# Altium schematic sheet 1power.SchDoc
size A4; SheetNumber: 1; SheetTotal: 2
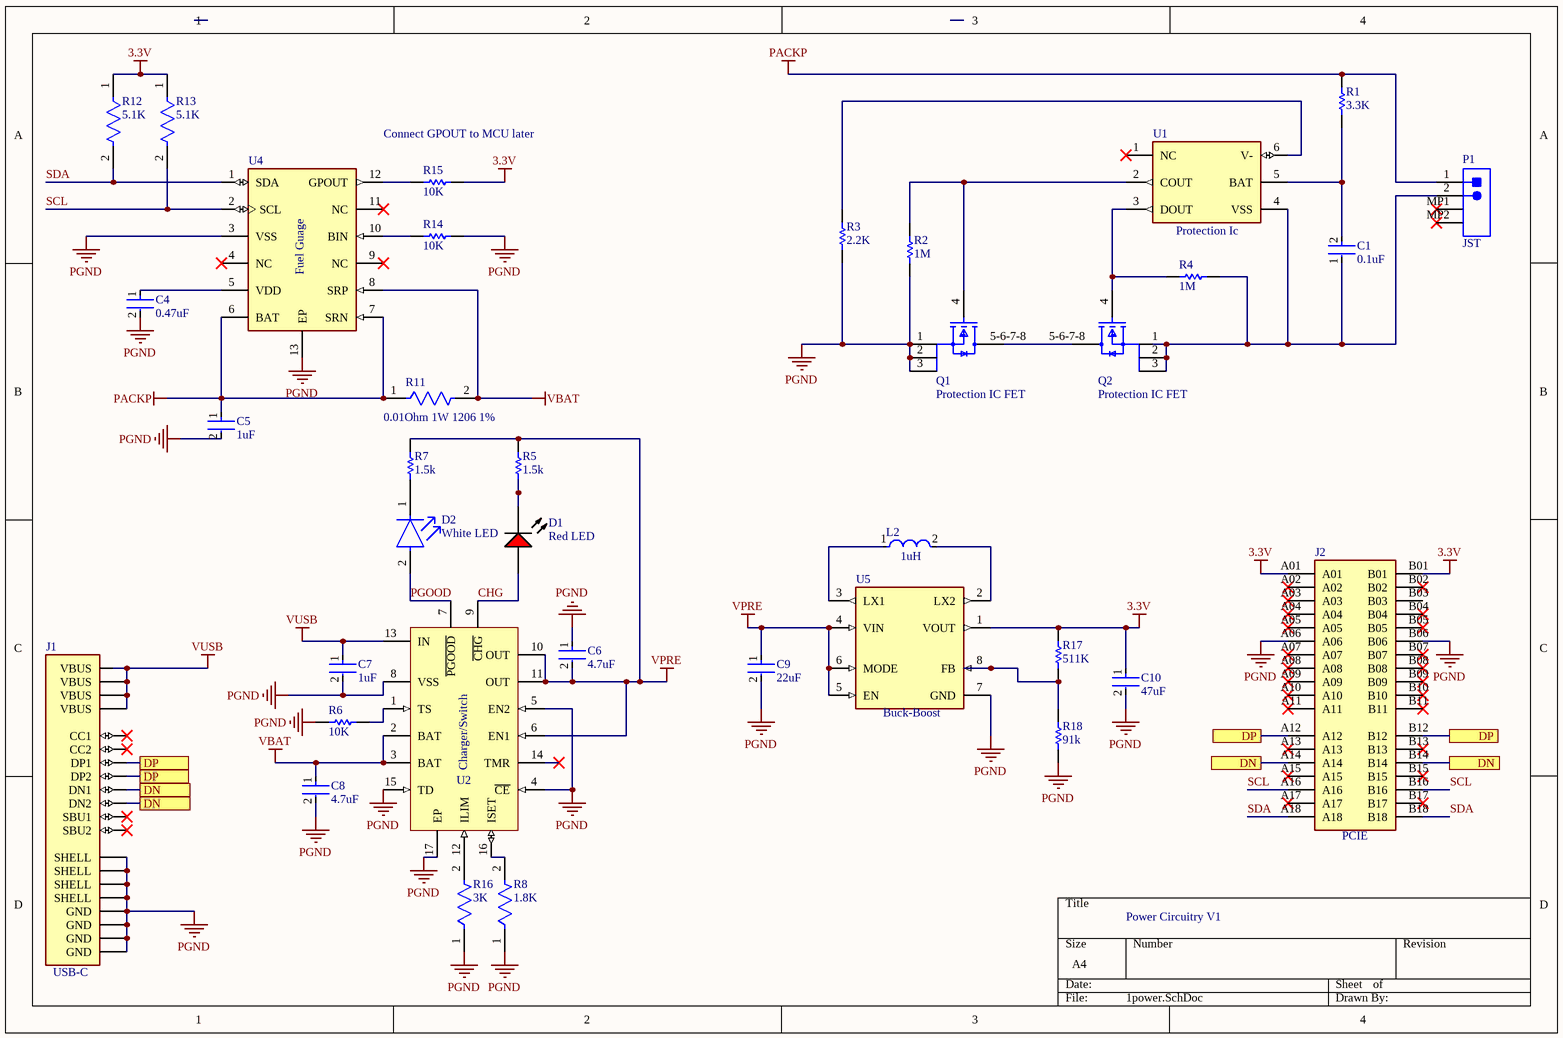
[diagram p0: 1power.SchDoc]

## Parts
C1  0.1uF  [FP-GRM15-MFG]
C4  0.47uF  [FP-C0603C-CF-MFG]
C5  1uF  [FP-C0402C105K8PACTU-MFG]
C6  4.7uF  [FP-ZRB15X-0_15-MFG]
C7  1uF  [FP-C0402C105K8PACTU-MFG]
C8  4.7uF  [FP-ZRB15X-0_15-MFG]
C9  22uF  [FP-GRM187-0_2-IPC_C]
C10  47uF  [FP-GRM219-0_2-0_1-IPC_A]
D1  Red LED  [VISH-TLMS1000_V]
D2  White LED  [FP-6_541-5091_01-4-MFG]
J1  USB-C  [GCT_USB4085-GF-A_REVB]
J2  PCIE  [SAMTEC_PCIE-036-02-X-D-EMS3]
L2  1uH  [FP-DFE252012C-IPC_B]
P1  JST  [JST- S2B-PH-SM4-TB(LF)(SN)-2_V]
Q1  Protection IC FET  [FP-DQG0008A-MFG]
Q2  Protection IC FET  [FP-DQG0008A-MFG]
R1  3.3K  [RESC1005X40X25LL05T10]
R2  1M  [RESC1005X40X25NL05T10]
R3  2.2K  [RESC1005X40X25NL05T10]
R4  1M  [RESC1005X40X25NL05T10]
R5  1.5k  [RESC1005X40X25ML05T10]
R6  10K  [RESC1005X40X25LL05T10]
R7  1.5k  [RESC1005X40X25ML05T10]
R8  1.8K  [FP-CRCW0603-e3-IPC_A]
R11  0.01Ohm 1W 1206 1%  [FP-WSLP1206-FP_1_65x1_93x-MFG]
R12  5.1K  [FP-CRCW0402-e3-IPC_A]
R13  5.1K  [FP-CRCW0402-e3-IPC_A]
R14  10K  [RESC1005X40X25LL05T10]
R15  10K  [RESC1005X40X25LL05T10]
R16  3K  [FP-CRCW0603-e3-MFG]
R17  511K  [RESC1005X40X25ML05T05]
R18  91k  [RESC1005X40X25NL05T10]
U1  Protection Ic  [FP-DSE0006A-IPC_A]
U2  Charger/Switch  [RGT0016C_V]
U4  Fuel Guage  [FP-DRZ0012A-MFG]
U5  Buck-Boost  [SOT50P160X60-8N]

## Ports
DN (see 1power[1D], 1power[4C]), DP (see 1power[1C], 1power[1D], 1power[4C]), DP (see 1power[1C], 1power[4C]), DP (see 1power[1D], 1power[4C])

## Nets
3.3V: C10.1 J2.A01 J2.B01 R12.1 R13.1 R15.2 R17.2 U5.1(VOUT)
PACKP: C5.1 P1.1 R1.1 R11.1 U4.6(BAT) U4.7(SRN)
PGND: C4.2 C5.2 C6.1 C7.2 C8.2 C9.2 C10.2 J1.A1(GND) J1.A12(GND) J1.B1(GND) J1.B12(GND) J1.S1(SHELL) J1.S2(SHELL) J1.S3(SHELL) J1.S4(SHELL) J2.A06 J2.B06 Q1.1(S) Q1.2(S) Q1.3(S) R2.1 R3.1 R6.1 R8.1 R14.2 R16.1 R18.1 U2.4(~{CE}) U2.5(EN2) U2.8(VSS) U2.15(TD) U2.17(EP) U4.3(VSS) U4.13(EP) U5.7(GND)
VBAT: C8.1 R11.2 U2.2(BAT) U2.3(BAT) U4.8(SRP)
VPRE: C6.2 C9.1 R5.2 R7.2 U2.6(EN1) U2.10(OUT) U2.11(OUT) U5.4(VIN) U5.5(EN) U5.6(MODE)
VUSB: C7.1 J1.A4(VBUS) J1.A9(VBUS) J1.B4(VBUS) J1.B9(VBUS) U2.13(IN)
CHG: D1.1(A) U2.9(~{CHG})
DN: J1.A7(DN1) J1.B7(DN2) J2.A14 J2.B14 ; port DN
DP: J1.A6(DP1) J1.B6(DP2) J2.A12 J2.B12 ; port DP
PGOOD: D2.2(A) U2.7(~{PGOOD})
SCL: J2.A16 J2.B16 R13.2 U4.2(SCL)
SDA: J2.A18 J2.B18 R12.2 U4.1(SDA)
NetC1_1: C1.1 P1.2 Q2.1(S) Q2.2(S) Q2.3(S) R4.2 U1.4(VSS)
NetC1_2: C1.2 R1.2 U1.5(BAT)
NetC4_1: C4.1 U4.5(VDD)
NetD1_2: D1.2(K) R5.1
NetD2_1: D2.1(C) R7.1
NetL2_1: L2.1 U5.3(LX1)
NetL2_2: L2.2 U5.2(LX2)
NetQ1_4: Q1.4(G) R2.2 U1.2(COUT)
NetQ1_5-6-7-8: Q1.5-6-7-8(D) Q2.5-6-7-8(D)
NetQ2_4: Q2.4(G) R4.1 U1.3(DOUT)
NetR3_2: R3.2 U1.6(V-)
NetR6_2: R6.2 U2.1(TS)
NetR8_2: R8.2 U2.16(ISET)
NetR14_1: R14.1 U4.10(BIN)
NetR15_1: R15.1 U4.12(GPOUT)
NetR16_2: R16.2 U2.12(ILIM)
NetR17_1: R17.1 R18.2 U5.8(FB)

Not connected (* = marked no-connect by the designer): J1 A5(CC1)* A8(SBU1)* B5(CC2)* B8(SBU2)*; J2 A02* A03* A04* A05* A07* A08* A09* A10* A11* A13* A15* A17* B02* B03 B04* B05* B07* B08* B09* B10* B11* B13* B15* B17*; P1 MP1* MP2*; U1 1(NC)*; U2 14(TMR)*; U4 4(NC)* 9(NC)* 11(NC)*

## Notes on the sheet
- Connect GPOUT to MCU later
- Power Circuitry V1

## Library data of the parts
C1 = CMP-2100-03641-2: CAP CER 0.1UF 16V X7R 0402; Manufacturer Part Number: GRM155R71C104KA88D; Manufacturer: Murata; Standoff Height: 0mm; Tolerance: 10%; Voltage Rating: 16Vdc; Material: Ceramic; Capacitance: 0.10μF; Value: 0.10μF; RoHS: TRUE; Temperature Characteristic: X7R; Octopart: https://octopart.com/grm155r71c104ka88d-murata-196880; Digikey Description: CAP CER 0.1UF 16V X7R 0402; Device Class L3: Ceramic Capacitors; Height: 0.55mm; ComponentLink2Description: Datasheet; Temperature Range Low: -55°C; Ipc Land Pattern Name: CAPC10050X219; ComponentLink2URL: https://search.murata.co.jp/Ceramy/image/img/A01X/G101/ENG/GRM155R71H471KA01-01A.pdf; Device Class L1: Passive Components; Lead Free: yes; Category: Cap; Package: GRM15; Temperature: -55°C to +125°C; Device Class L2: Capacitors; Temperature Range High: +125°C; Mouser Description: 0402 0.1 uF 16V ±10 % Tolerance X7R SMT Multilayer Ceramic Capacitor
C4 = CMP-2006-03235-2: CAP CER 0.47UF 16V X7R 0603; Manufacturer Part Number: C0603C474K4RACTU; Manufacturer: KEMET; Automotive Grade: Grade 1; Value: 0.47 μF; Tolerance: 0.1; Temperature Coefficient: 30ppm/°C; Material: Ceramic; Device Class L3: Ceramic Capacitors; ComponentLink2URL: https://api.kemet.com/component-edge/download/datasheet/C0603C100J5GACAUTO.pdf; Height: 0.87mm; ComponentLink2Description: Datasheet; Device Class L2: Capacitors; Temperature Range Low: -55°C; Temperature Range High: +125°C; RoHS: TRUE; Mouser Description: 0603 C 470nF Ceramic Multilayer Capacitor, 16 V, +125degC, X7R Dielec, +/-10%; Temperature Characteristic: X7R; Digikey Description: CAP CER 0.47UF 16V X7R 0603; Lead Free: Yes; Automotive: Yes; Octopart: https://octopart.com/c0603c474k4ractu-kemet-109683; Capacitance: 0.47 μF; Package: C0603C-CF; Voltage Rating: 16 V; Device Class L1: Passive Components; Category: Cap; Temperature: -55°C to +125°C
C5 C7 = CMP-2008-02081-2: CAP CER 1UF 10V X5R 0402; Dielectric Material: Ceramic; Dissipation Factor: 5%; Tolerance: 10%; Number of Pins: 2; Contact Plating: Tin; Min Operating Temperature: -55°C; Termination: SMD/SMT; Lead Free: Lead Free; Construction: Flat; Voltage Rating (DC): 10V; Mount: Surface Mount; Series: C; Thickness: 0.022inch; Width: 0.5mm; Radiation Hardening: No; Capacitance: 1uF; Dielectric: X5R; Height: 0.5mm; Voltage: 10V; Length: 1mm; Depth: 0.5mm; Max Operating Temperature: 85°C; Package Quantity: 1; Packaging: Tape and Reel; RoHS Compliant: Yes; Case Code (Imperial): 0402; Case Code (Metric): 1005; REACH SVHC: No SVHC; Voltage Rating: 10V; Case/Package: 0402
C6 C8 = CMP-06035-062377-1: CAP CER 4.7UF 10V X5R 0402; Tolerance: 20%; Case Code (Metric): 1005; Height: 0.65mm; Mount: Surface Mount; Voltage Rating: 10V; Case/Package: 0402; Max Operating Temperature: 85°C; Width: 0.02inch; Min Operating Temperature: -55°C; Thickness: 0.031inch; Length: 0.039inch; Dielectric: X5R; Voltage Rating (DC): 10V; Capacitance: 4.7uF; Voltage: 10V; REACH SVHC: No SVHC; RoHS Compliant: Yes; Packaging: Cut Tape; Depth: 0.5mm; Case Code (Imperial): 0402
C9 = CMP-06035-049226-1: Chip Multilayer Ceramic Capacitors for General Purpose, 0603, 22uF, X5R, 15%, 20%, 10V; Dielectric: X5R; Capacitance: 22uF; Voltage Rating: 10V; Case/Package: 0603; Case Code (Imperial): 0603; Voltage Rating (DC): 10V; Mount: Surface Mount; Length: 0.063inch; Width: 0.031inch; Max Operating Temperature: 85°C; Thickness: 0.031inch; Tolerance: 20%; Case Code (Metric): 1608; Packaging: Tape and Reel; Min Operating Temperature: -55°C
C10 = CMP-06035-004086-1: Chip Multilayer Ceramic Capacitors for General Purpose, 0805, 47uF, X5R, 15%, 20%, 6.3V; Case Code (Metric): 2012; Voltage Rating: 6.3V; Case Code (Imperial): 0805; Max Operating Temperature: 85°C; Width: 0.049inch; Length: 0.079inch; Min Operating Temperature: -55°C; Mount: Surface Mount; Packaging: Tape and Reel; Case/Package: 0805; Thickness: 0.037inch; Capacitance: 47uF; Tolerance: 20%
D1 = CMP-2000-07254-1: Low Current LED, 40 mW, 1.8 V, -40 to 100 degC, 2-Pin SMD (0603), RoHS, Tape and Reel; Manufacturer: Vishay; Lens Shape: Rectangular; Automotive Qualification Standard: AEC-Q100; Wavelength Typ: 636nm; SVHC: ToBeAdvised; Bulb Size: 1.6mmx0.8mm; Forward Voltage: 1.8V; Luminous Intensity: 4mcd; Forward Current If: 2mA; Viewing Angle: 80°; Datasheet Version: Rev. 1.7, 02/2011; Datasheet URL: https://datasheet.ciiva.com/5798/1698881-5798337.pdf; LED Mounting: SMD; Packaging: CutTape; Package Reference: TLMS1000; Manufacturer URL: http://www.vishay.com/; Mounting Technology: SurfaceMount; Product Range: -; LED Colour: Red; Package Description: 2-Pin Surface Mount Device, Body 1.6 x 0.8 mm; MSL: MSL2-1year
D2 = CMP-02520-000007-1: LED COOL WHITE 0603 SMD; Manufacturer: Vishay; Manufacturer Part Number: VLMW1300-GS08; Viewing Angle: 130°; Forward Voltage: 3.15V; Luminous Intensity: 180mcd; Forward Current: 5mA; Led Orientation: Top View; Power Dissipation: 70mW; Category: Diode; Device Class L2: LEDs; Device Class L1: Optoelectronics; ComponentLink2URL: http://www.vishay.com/docs/82435/vlmw1300.pdf; Octopart: https://octopart.com/vlmw1300-gs08-vishay-21709203; Mouser Description: LED; SMD; 0603; white cold; 45-180mcd; 7000(typ)K; 130°; 5mA; Automotive: No; Ambient Temperature Range High: +80°C; Colour: White; Device Class L3: unset; Temperature Range High: +80°C; Height: 0.75mm; Package: 6.541-5091.01-4; RoHS: TRUE; Digikey Description: LED COOL WHITE 0603 SMD; Lead Free: Yes; Ambient Temperature Range Low: -20°C; ComponentLink2Description: Datasheet; Temperature Range Low: -20°C; Temperature: -20°C to +80°C
J1 = USB4085-GF-A_REVB: USB-C (USB TYPE-C) USB 2.0 æ’åº§è¿žæŽ¥å™¨ 24 (16+8 Dummy) ä½é€šå­”ã€ç›´è§’ã€ä½Žæˆæœ¬ã€3.46mm å¤–å½¢ã€16 é’ˆã€æ°´å¹³ã€é¡¶éƒ¨å®‰è£…; MF: Global Connector Technology; SnapEDA_Link: https://www.snapeda.com/parts/USB4085-GF-A/Global+Connector+Technology/view-part/?ref=snap; Package: None; Value: *; MP: USB4085-GF-A; Check_prices: https://www.snapeda.com/parts/USB4085-GF-A/Global+Connector+Technology/view-part/?ref=eda
J2 = PCIE-036-02-X-D-EMS3: PCI EXPRESS EDGE MOUNT ASSEMBLY,36PINS.; Package: None; Price: None; Value: *; MP: PCIE-036-02-X-D-EMS3; Availability: Unavailable
L2 = CMP-06042-006150-1: Shielded Wirewound Inductor 1uH 20% 3200mA 0.042Ω 1008 (2520), DFE252012P-1R0M=P2; Core Material: Ferrite; Current Rating: 4.3A; Test Frequency: 1MHz; DC Resistance (DCR): 42mR; Max DC Current: 3.2A; Tolerance: 20%; Resistor Type: Wirewound; Inductance: 1uH; Length: 0.098inch; Min Operating Temperature: -40°C; Case Code (Imperial): 1008; Mount: Surface Mount; Depth: 2mm; Height - Seated (Max): 0.039inch; Max Operating Temperature: 125°C; Width: 0.079inch; Case/Package: 1008; Packaging: Tape and Reel; Case Code (Metric): 2520; Shielding: Shielded
P1 = CMP-1755-00001-1: Male Header, Pitch 2 mm, 1 x 2 Position, Height 5.5 mm, -25 to 85 degC, RoHS, Tape and Reel; Current Rating: 3 A; ComponentLink1URL: http://www.jst.com/home2.html; Radiation Hardening: No; RoHSCompliant: True; Mount: Through Hole; Contact Material: Bronze; Package Quantity: 100; Width: 2.34 mm; DatasheetVersion: Dec-12; Height: 8.13 mm; Max Operating Temperature: 105degC; ComponentLink2Description: Datasheet; Lead Pitch: 0.1 inch; Contact Finish: Lead; Packaging: Bulk; Colour: Black; Contact Plating: Tin; Min Operating Temperature: -65degC; ComponentLink1Description: Manufacturer URL; PackageReference: S2B-PH-SM4-TB(LF)(SN)-2; PackageDescription: Male Header, Pitch 2 mm, 1 x 2 Position, Height 5.5 mm; ComponentLink2URL: http://www.jst-mfg.com/product/pdf/eng/ePH.pdf; Pins: 40; Length: 101.19 mm
Q1 Q2 = CMP-04962-000044-1: Protection IC FET, MOSFET N-CH 25V 60A 8-SON, CSD16406Q3; Nominal Vgs: 1.7V; Power Dissipation: 2.7W; Element Configuration: Single; Input Capacitance: 1.1nF; Turn-Off Delay Time: 8.5ns; Number of Elements: 1; Rise Time: 12.9ns; Turn-On Delay Time: 7.3ns; Rds On Max: 5.3mR; Polarity: N-CHANNEL; Gate to Source Voltage (Vgs): 16V; Fall Time: 4.8ns; REACH SVHC: No SVHC; Max Operating Temperature: 150°C; Lead Free: Contains Lead; Contact Plating: Tin; Radiation Hardening: No; Series: NexFET™; Dual Supply Voltage: 25V; Mount: Surface Mount; Continuous Drain Current (ID): 60A; Threshold Voltage: 1.7V; RoHS Compliant: Yes; Package Quantity: 1; Min Operating Temperature: -55°C; Packaging: Tape and Reel; Number of Pins: 8; Termination: SMD/SMT; Max Power Dissipation: 2.7W; Case/Package: SON; Drain to Source Breakdown Voltage: 25V; Drain to Source Voltage (Vdss): 25V; Supplier 1: Mouser; Supplier Part Number 1: 595-CSD16406Q3
R1 = CMP-2002-07652-1: Manufacturer: Yageo / Phycomp; Part Number: RC0402FR-073K3L
R2 R4 = CMP-2002-07490-1: Manufacturer: Yageo / Phycomp; Part Number: RC0402FR-071ML
R3 = CMP-2002-07567-1: Manufacturer: Yageo / Phycomp; Part Number: RC0402FR-072K2L
R5 R7 = CMP-2002-07464-1: Manufacturer: Yageo / Phycomp; Part Number: RC0402FR-071K5L
R6 R14 R15 = CMP-2002-07353-1: Part Number: RC0402FR-0710KL; Manufacturer: Yageo / Phycomp
R8 = CMP-02407-005782-1: RES Thick Film, 1.8kΩ, 1%, 0.1W, 100ppm/°C, 0603; Voltage Rating (DC): 75V; Max Power Dissipation: 100mW; Resistance: 1.8kR; Depth: 0.85mm; Contact Plating: Tin; Max Operating Temperature: 155°C; Package Quantity: 5000; Radiation Hardening: No; Temperature Coefficient: 100ppm/°C; Packaging: Tape and Reel; Number of Terminations: 2; Case Code (Imperial): 0603; Lead Free: Lead Free; Case/Package: 0603; Military Standard: Not; Weight: 7.1E-05oz; Tolerance: 1%; Height: 0.45mm; Min Operating Temperature: -55°C; Length: 1.55mm; Voltage Rating: 75V; Power Rating: 100mW; Width: 0.033inch; Composition: Thick Film; Case Code (Metric): 1608; Termination: SMD/SMT; Features: Automotive AEC-Q200
R11 = CMP-2003-04373-2: RES 0.01 OHM 1% 1W 1206; Temperature Coefficient: 75ppm/°C; Resistance: 10mR; Features: Moisture Resistant; Case/Package: 1206; Military Standard: Not; Case Code (Imperial): 1206; Power Rating: 1W; Number of Terminations: 2; Lead Free: Lead Free; Number of Pins: 2; Min Operating Temperature: -65°C; Weight: 0.000571oz; Radiation Hardening: No; Series: WSLP; Length: 3.2mm; Termination: SMD/SMT; Mount: Surface Mount; Size Code: 1206; Height: 0.035inch; Case Code (Metric): 3216; Resistance Tolerance: 1%; Contact Plating: Tin; Width: 0.063inch; Construction: Rectangular; Packaging: Tape and Reel; Package Quantity: 1; RoHS Compliant: Yes; Depth: 1.6mm; Tolerance: 1%; Max Operating Temperature: 170°C; Max Power Dissipation: 1W; Resistor Type: Metal Strip
R12 R13 = CMP-1011-00590-4: RES Thick Film, 5.1kΩ, 1%, 0.063W, 100ppm/°C, 0402; Voltage Rating: 50V; Max Power Dissipation: 63mW; Resistance: 5.1kR; Case/Package: 0402; Min Operating Temperature: -55°C; Height: 0.35mm; Contact Plating: Tin; Tolerance: 1%; Max Operating Temperature: 155°C; Lead Free: Lead Free; Number of Terminations: 2; Temperature Coefficient: 100ppm/°C; Weight: 2.3E-05oz; Termination: SMD/SMT; Radiation Hardening: No; Voltage Rating (DC): 50V; Length: 1mm; Features: Automotive AEC-Q200; Case Code (Metric): 1005; Width: 0.02inch; Package Quantity: 10; Military Standard: Not; Depth: 0.5mm; Packaging: Tape and Reel; Power Rating: 63mW; Case Code (Imperial): 0402; Composition: Thick Film
R16 = CMP-2000-03293-2: RES Thick Film, 3kΩ, 1%, 0.1W, 100ppm/°C, 0603; Voltage Rating: 75V; Resistance: 3kR; Power Rating: 100mW; Features: Automotive AEC-Q200; Radiation Hardening: No; Contact Plating: Tin; Termination: SMD/SMT; Lead Free: Lead Free; Case Code (Imperial): 0603; Case Code (Metric): 1608; Case/Package: 0603; Depth: 0.85mm; Mount: Surface Mount; Voltage Rating (DC): 75V; Tolerance: 1%; Package Quantity: 10; Temperature Coefficient: 100ppm/°C; Height: 0.45mm; Max Power Dissipation: 100mW; Composition: Thick Film; Max Operating Temperature: 155°C; Military Standard: Not; Weight: 7.1E-05oz; Length: 1.55mm; Packaging: Tape and Reel; Number of Terminations: 2; Width: 0.85mm; Min Operating Temperature: -55°C
R17 = CMP-2002-00976-1: Part Number: ERJ-2RKF5113X; Manufacturer: Panasonic
R18 = CMP-2002-07040-1: Manufacturer: Yageo / Phycomp; Part Number: RC0402FR-0791KL
U1 = BQ29701DSER: Power Supply Support Circuit, Fixed, 1 Channel, PDSO6; Manufacturer: Texas Instruments; Package Body Material: Plastic; Adjustable Threshold: No; Number of Channels: 1; Max Supply Voltage: 8V; Min Supply Voltage: 1.5V; Nominal Supply Voltage: 3.6V; Supplier: Digikey; Supplier Part Number: 296-39944-1-ND; Manufacturer Part Number: BQ29701DSER; RoHS: Yes; Category: Battery Management; Stock: 825; Pricing: 1=0.45, 10=0.316, 25=0.2824, 100=0.2448, 250=0.22688, 500=0.2161, 1000=0.20722, 3000=0.19625, 6000=0.19088, 9000=0.18819, 15000=0.18521, 21000=0.18347, 30000=0.18179 (USD); Case/Package: VSON; Pins: 6; Package Shape: Square; Terminal Finish: Nickel; Min Operating Temperature: -40°C; Max Operating Temperature: 85°C; JESD-609 Code: e4; Throw Configuration: POWER SUPPLY SUPPORT CIRCUIT; JESD-30 Code: S-PDSO-N6; Moisture Sensitivity Level: 1; Channels: 1; Package Style: SMALL OUTLINE, VERY THIN PROFILEMeter; Peak Reflow Temperature (Cel): 260°C; Surface Mount: Yes; Terminal Form: No Lead; Terminal Position: DUAL; Length: 1.5mm; Width: 1.5mm; Height - Seated (Max): 0.8mm; Terminal Pitch: 0.5mm; Temperature Grade: INDUSTRIAL; Reach SVHC Compliant: Yes; RoHS Compliant: Yes; ComponentLink1URL: https://www.ti.com:443/lit/ds/symlink/bq2970.pdf?src-supplier=IHS+Markit; ComponentLink1Description: https://www.ti.com:443/lit/ds/symlink/bq2970.pdf?src-supplier=IHS+Markit; ComponentLink2URL: http://www.ti.com/lit/gpn/bq2970?src-supplier=Mouser; ComponentLink2Description: http://www.ti.com/lit/gpn/bq2970?src-supplier=Mouser; ComponentLink3URL: http://www.ti.com/lit/ds/symlink/bq2971.pdf?src-supplier=Digikey; ComponentLink3Description: http://www.ti.com/lit/ds/symlink/bq2971.pdf?src-supplier=Digikey; ComponentLink4URL: http://www.ti.com/general/docs/suppproductinfo.tsp?distId=10&amp;gotoUrl=http%3A%2F%2Fwww.ti.com%2Flit%2Fgpn%2Fbq2971&src-supplier=Digikey; ComponentLink4Description: http://www.ti.com/general/docs/suppproductinfo.tsp?distId=10&amp;gotoUrl=http%3A%2F%2Fwww.ti.com%2Flit%2Fgpn%2Fbq2971&src-supplier=Digikey; ComponentLink5URL: http://www.ti.com/general/docs/lit/getliterature.tsp?genericPartNumber=BQ2970&&fileType=pdf&src-supplier=Avnet; ComponentLink5Description: http://www.ti.com/general/docs/lit/getliterature.tsp?genericPartNumber=BQ2970&&fileType=pdf&src-supplier=Avnet; Supplier 1: Digikey; Supplier Part Number 1: 296-39944-1-ND
U2 = CMP-0321-00226-2: USB-Friendly Li-Ion Battery Charger and Power-Path Management IC, Vout 200 mV above Vbat, 4.3 V, -40 to 85 degC, 16-pin QFN (RGT), Green (RoHS & no Sb/Br); PartNumber: BQ24072RGTT; Manufacturer: Texas Instruments; Over Voltage Protection: N; Vin(Min)(V): 4.3; SubFamily: Battery Charge Management; Li-Polymer: Y; PackageReference: RGT0016C; Eco-Plan: Green (RoHS & no Sb/Br); Mounting Technology: Surface Mount; DatasheetVersion: SLUS810G; Lead Acid: N; Code_JEDEC: MO-220; ComponentLink1Description: Datasheet; PackageVersion: revH, Oct-2011; PackageDescription: 16-Pin Plastic Quad Flat No-Lead, 3 x 3 mm Body, 0.5 mm Pitch, 1.7 x 1.7 mm Exposed Pad; NiCd: N; NiMH: N; ComponentLink1URL: http://www.ti.com/general/docs/lit/getliterature.tsp?genericPartNumber=BQ24072&fileType=pdf; Li-Ion: Y
U4 = CMP-04911-000005-1: IC BATT FUEL GAUGE LICOO2 12SON; Manufacturer: Texas Instruments; Manufacturer Part Number: BQ27441DRZT-G1A; Nominal Supply Current: 93uA; Standoff Height: 0mm; Output Voltage: 1.8V; Number Of Outputs: 1; Min Supply Voltage: 2.45V; Max Supply Voltage: 4.5V; ComponentLink2URL: http://www.ti.com/lit/ds/symlink/bq27441-g1.pdf; Device Class L1: Integrated Circuits (ICs); Package: DRZ0012A; Number Of Cells: 1; Mouser Description: Battery Management System-Side Impdance Trck Bttry Fuel Gge; ComponentLink2Description: Datasheet; Device Class L2: Power Management ICs; Temperature Range High: +85°C; Category: IC; Automotive: No; Octopart: https://octopart.com/bq27441drzt-g1a-texas+instruments-30555831; Temperature Range Low: -40°C; Device Class L3: Battery Management; RoHS: TRUE; Height: 1mm; Digikey Description: IC BATT FUEL GAUGE LICOO2 12SON; Temperature: -40°C to +85°C; Ambient Temperature Range High: +85°C; Ambient Temperature Range Low: -40°C; Lead Free: Yes
U5 = TPS631000DRLR: 1.5-A output current, high-power-density buck-boost converter; MF: Texas Instruments; SnapEDA_Link: https://www.snapeda.com/parts/TPS631000DRLR/Texas+Instruments/view-part/?ref=snap; Package: SOT-583 Texas Instruments; Value: *; MP: TPS631000DRLR; Check_prices: https://www.snapeda.com/parts/TPS631000DRLR/Texas+Instruments/view-part/?ref=eda